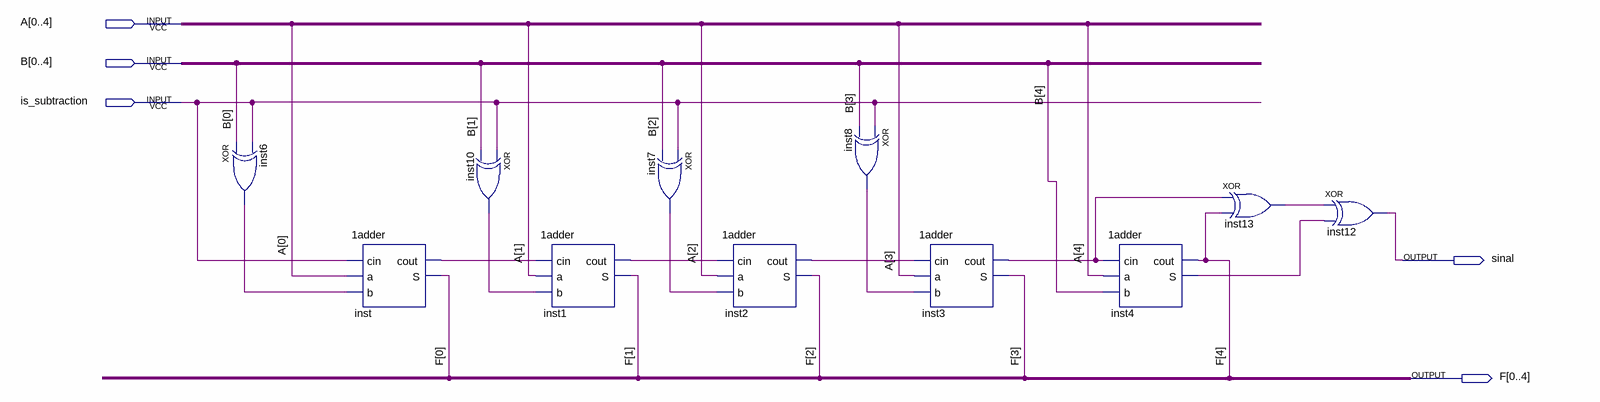
[diagram p0: schematic sheet]
// Quartus schematic fulladder.bdf as structural Verilog: 11 symbols, 5 pins
module fulladder (
  input  [0:4] A,
  input  [0:4] B,
  input  is_subtraction,
  output sinal,
  output [0:4] F
);

  wire inst1_cout, inst2_cout, inst3_cout, inst4_s, inst6_out, inst7_out, inst8_out, inst10_out, inst13_out,
       inst_cout;

  xor inst6 (inst6_out, B[0], is_subtraction);
  \1adder  inst (.cin(is_subtraction), .a(A[0]), .b(inst6_out), .cout(inst_cout), .S(F[0]));
  xor inst10 (inst10_out, is_subtraction, B[1]);
  \1adder  inst1 (.cin(inst_cout), .a(A[1]), .b(inst10_out), .cout(inst1_cout), .S(F[1]));
  xor inst7 (inst7_out, is_subtraction, B[2]);
  \1adder  inst2 (.cin(inst1_cout), .a(A[2]), .b(inst7_out), .cout(inst2_cout), .S(F[2]));
  xor inst8 (inst8_out, is_subtraction, B[3]);
  \1adder  inst3 (.cin(inst2_cout), .a(A[3]), .b(inst8_out), .cout(inst3_cout), .S(F[3]));
  \1adder  inst4 (.cin(inst3_cout), .a(A[4]), .b(B[4]), .cout(F[4]), .S(inst4_s));
  xor inst13 (inst13_out, inst3_cout, F[4]);
  xor inst12 (sinal, inst13_out, inst4_s);
endmodule
